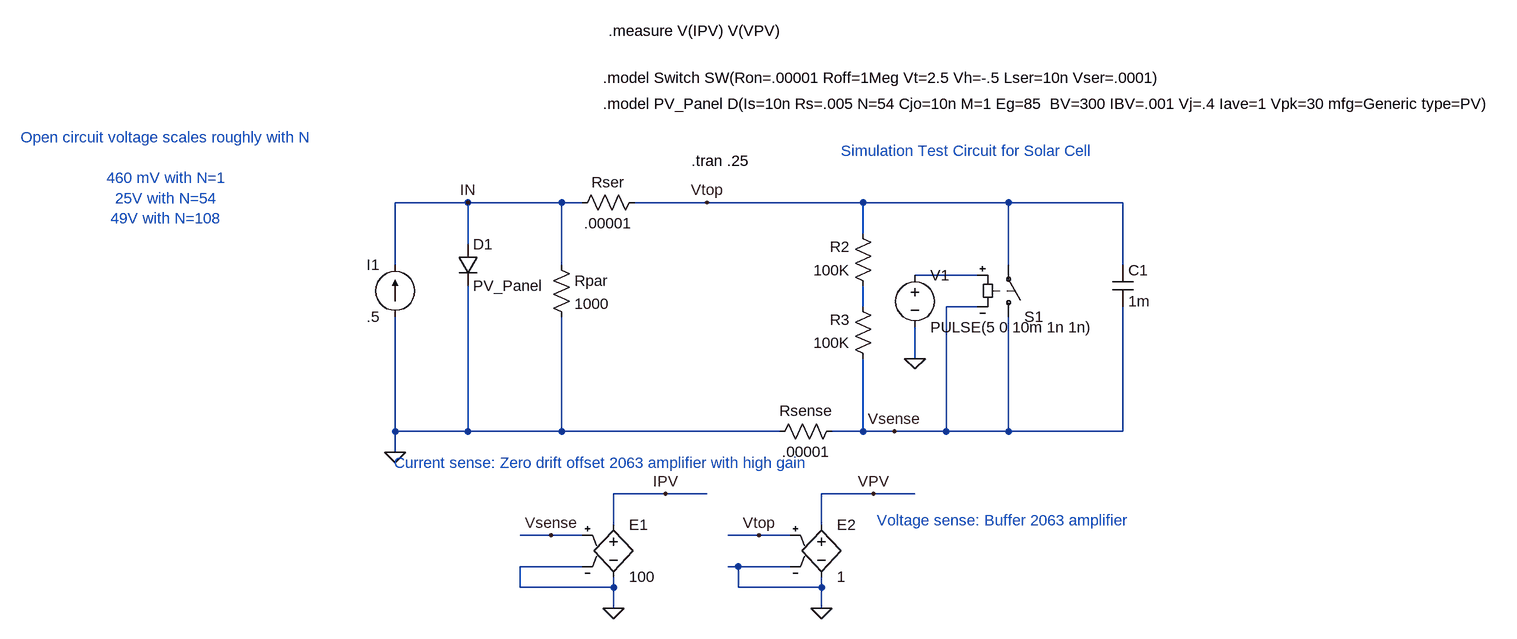
[diagram p0: schematic PhotoCell.asc]
PhotoCell.asc, the LTspice schematic file:
Version 4
SHEET 1 1404 1284
WIRE -608 144 -720 144
WIRE -464 144 -608 144
WIRE -432 144 -464 144
WIRE -240 144 -352 144
WIRE 0 144 -240 144
WIRE 224 144 0 144
WIRE 400 144 224 144
WIRE 0 192 0 144
WIRE -608 208 -608 144
WIRE -720 240 -720 144
WIRE -464 240 -464 144
WIRE 224 240 224 144
WIRE 400 240 400 144
WIRE 176 256 80 256
WIRE 0 304 0 272
WIRE 176 304 128 304
WIRE 80 384 80 336
WIRE -720 496 -720 320
WIRE -608 496 -608 272
WIRE -608 496 -720 496
WIRE -464 496 -464 320
WIRE -464 496 -608 496
WIRE -128 496 -464 496
WIRE 0 496 0 384
WIRE 0 496 -48 496
WIRE 48 496 0 496
WIRE 128 496 128 304
WIRE 128 496 48 496
WIRE 224 496 224 320
WIRE 224 496 128 496
WIRE 400 496 400 304
WIRE 400 496 224 496
WIRE -720 528 -720 496
WIRE -304 592 -384 592
WIRE -240 592 -304 592
WIRE 16 592 -64 592
WIRE 80 592 16 592
WIRE -384 640 -384 592
WIRE -64 640 -64 592
WIRE -480 656 -528 656
WIRE -432 656 -480 656
WIRE -160 656 -208 656
WIRE -112 656 -160 656
WIRE -432 704 -528 704
WIRE -192 704 -208 704
WIRE -112 704 -192 704
WIRE -528 736 -528 704
WIRE -384 736 -384 720
WIRE -384 736 -528 736
WIRE -192 736 -192 704
WIRE -64 736 -64 720
WIRE -64 736 -192 736
WIRE -384 768 -384 736
WIRE -64 768 -64 736
FLAG -608 144 IN
FLAG -240 144 Vtop
FLAG -384 768 0
FLAG -480 656 Vsense
FLAG -304 592 IPV
FLAG -64 768 0
FLAG -160 656 Vtop
FLAG 16 592 VPV
FLAG -720 528 0
FLAG 48 496 Vsense
FLAG 80 384 0
SYMBOL res 16 288 R180
WINDOW 0 36 76 Left 2
WINDOW 3 36 40 Left 2
SYMATTR InstName R2
SYMATTR Value 100K
SYMBOL res 16 400 R180
WINDOW 0 36 76 Left 2
WINDOW 3 36 40 Left 2
SYMATTR InstName R3
SYMATTR Value 100K
SYMBOL res -32 480 R90
WINDOW 0 0 56 VBottom 2
WINDOW 3 32 56 VTop 2
SYMATTR InstName Rsense
SYMATTR Value .00001
SYMBOL sw 224 336 M180
SYMATTR InstName S1
SYMATTR Value ""
SYMATTR SpiceModel Switch
SYMBOL cap 384 240 R0
SYMATTR InstName C1
SYMATTR Value 1m
SYMBOL voltage 80 240 R0
WINDOW 123 0 0 Left 2
WINDOW 39 0 0 Left 2
SYMATTR InstName V1
SYMATTR Value PULSE(5 0 10m 1n 1n)
SYMBOL diode -624 208 R0
SYMATTR InstName D1
SYMATTR Value PV_Panel
SYMBOL res -448 160 R270
WINDOW 0 32 56 VTop 2
WINDOW 3 0 56 VBottom 2
SYMATTR InstName Rser
SYMATTR Value .00001
SYMBOL res -480 224 R0
SYMATTR InstName Rpar
SYMATTR Value 1000
SYMBOL current -720 320 R180
WINDOW 0 24 80 Left 2
WINDOW 3 24 0 Left 2
WINDOW 123 0 0 Left 2
WINDOW 39 0 0 Left 2
SYMATTR InstName I1
SYMATTR Value .5
SYMBOL e -384 624 R0
SYMATTR InstName E1
SYMATTR Value 100
SYMBOL e -64 624 R0
SYMATTR InstName E2
SYMATTR Value 1
TEXT 160 80 Bottom 2 ;Simulation Test Circuit for Solar Cell
TEXT -264 80 Left 2 !.tran .25
TEXT -400 -48 Left 2 !.model Switch SW(Ron=.00001 Roff=1Meg Vt=2.5 Vh=-.5 Lser=10n Vser=.0001)
TEXT -400 -8 Left 2 !.model PV_Panel D(Is=10n Rs=.005 N=54 Cjo=10n M=1 Eg=85  BV=300 IBV=.001 Vj=.4 Iave=1 Vpk=30 mfg=Generic type=PV)
TEXT -392 -120 Left 2 !.measure V(IPV) V(VPV)
TEXT -400 560 Bottom 2 ;Current sense: Zero drift offset 2063 amplifier with high gain
TEXT 216 648 Bottom 2 ;Voltage sense: Buffer 2063 amplifier
TEXT -1072 184 Bottom 2 ;Open circuit voltage scales roughly with N\n \n460 mV with N=1\n25V with N=54\n49V with N=108

The netlist it stands for:
* PhotoCell.asc
R2 N002 Vtop 100K
R3 Vsense N002 100K
Rsense Vsense 0 .00001
S1 Vsense Vtop N001 Vsense Switch
C1 Vtop Vsense 1m
V1 N001 0 PULSE(5 0 10m 1n 1n)
D1 IN 0 PV_Panel
Rser IN Vtop .00001
Rpar IN 0 1000
I1 0 IN .5
E1 IPV 0 Vsense 0 100
E2 VPV 0 Vtop 0 1
.model D D
.lib standard.dio
* Simulation Test Circuit for Solar Cell
.tran .25
.model Switch SW(Ron=.00001 Roff=1Meg Vt=2.5 Vh=-.5 Lser=10n Vser=.0001)
.model PV_Panel D(Is=10n Rs=.005 N=54 Cjo=10n M=1 Eg=85  BV=300 IBV=.001 Vj=.4 Iave=1 Vpk=30 mfg=Generic type=PV)
.measure V(IPV) V(VPV)
* Current sense: Zero drift offset 2063 amplifier with high gain
* Voltage sense: Buffer 2063 amplifier
* Open circuit voltage scales roughly with N
* 460 mV with N=1
* 25V with N=54
* 49V with N=108
.backanno
.end